# EAGLE design HWProgUSB (EAGLE 6.3)
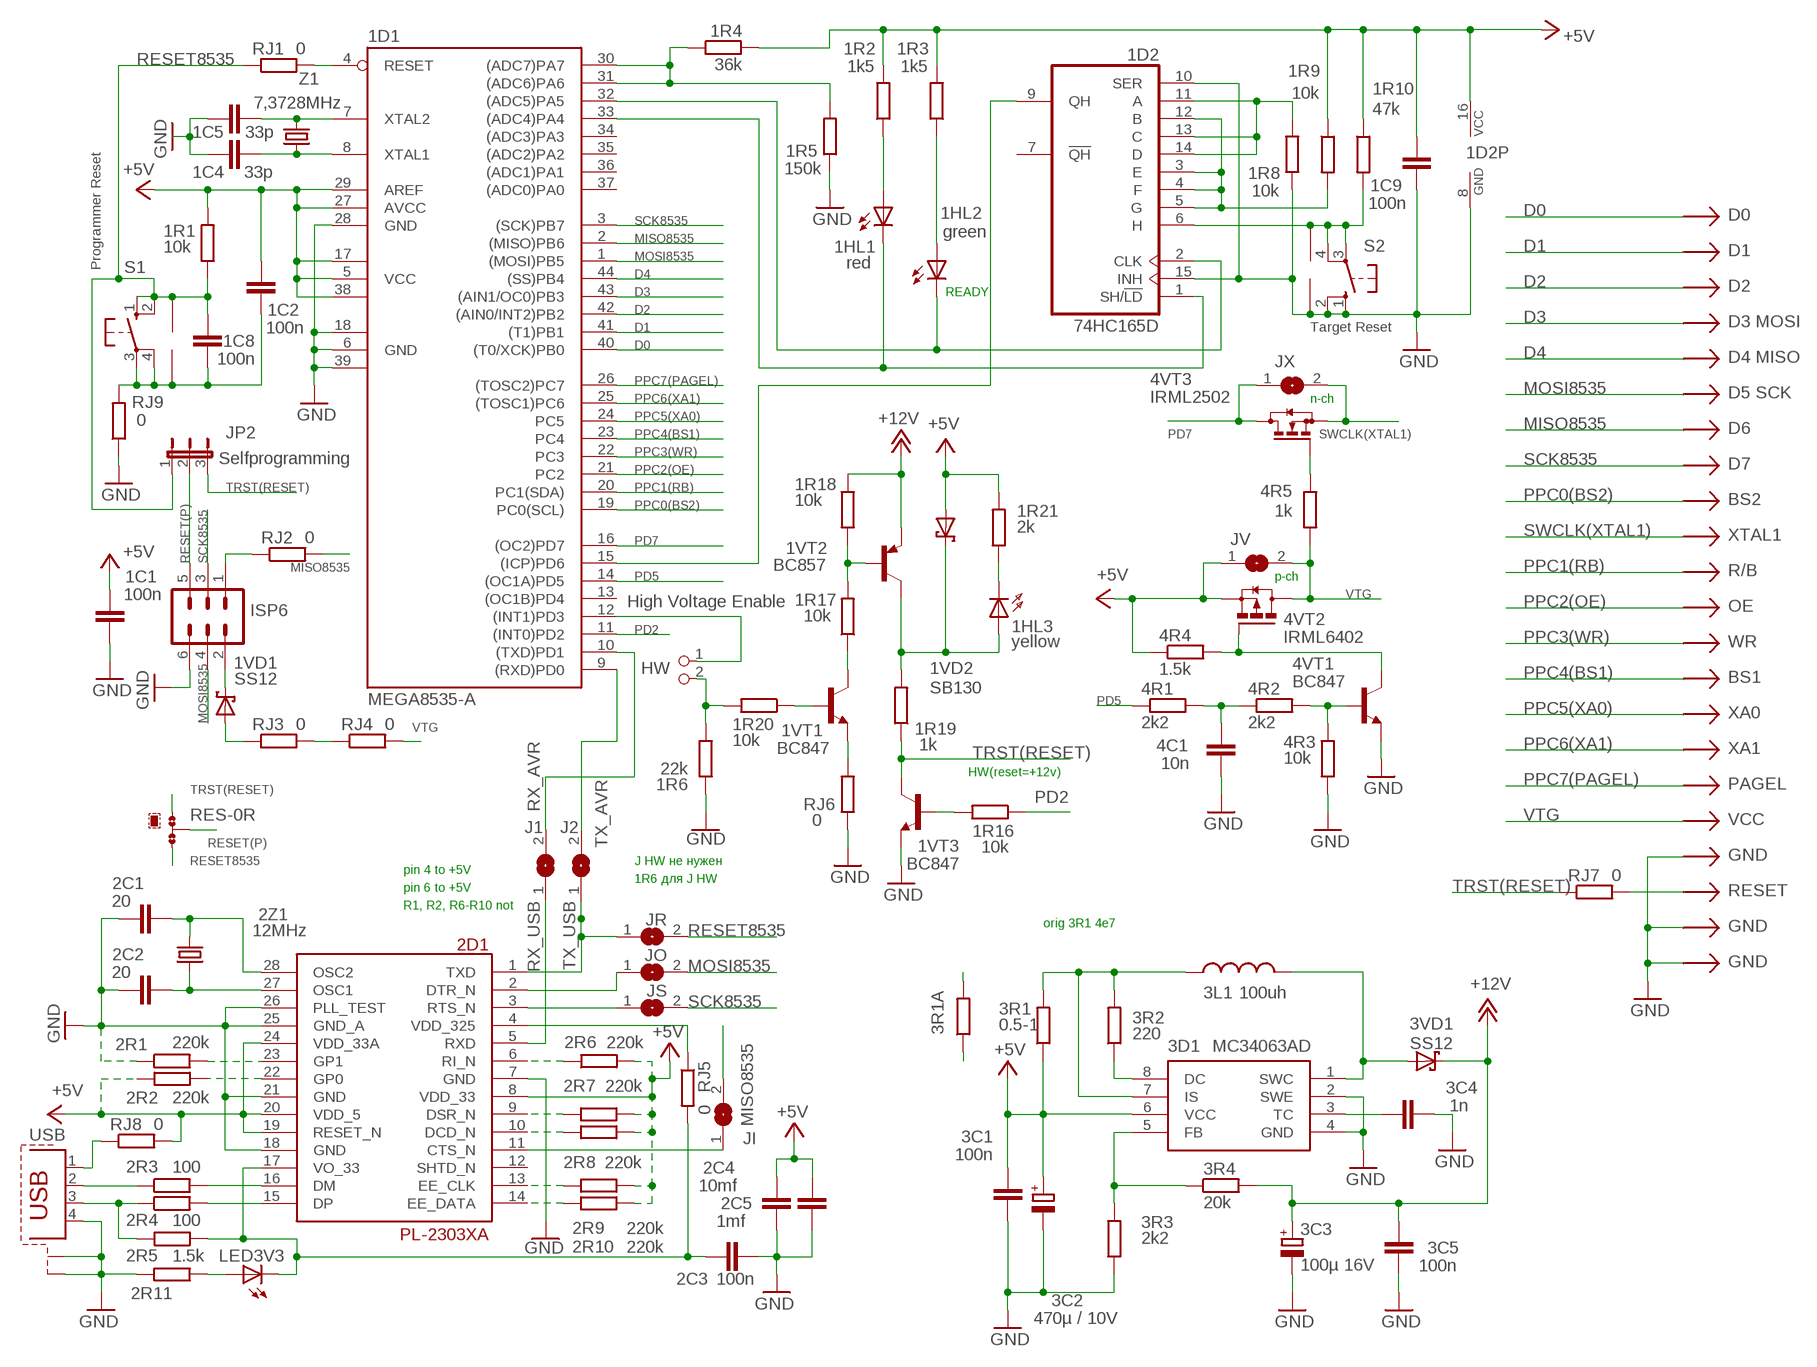
[diagram p0: schematic, sheet 1]

## Parts
1C1  100n  C-EUC0805  [C0805]
1C2  100n  C-EUC0805  [C0805]
1C4  33p  C-EUC0805  [C0805]
1C5  33p  C-EUC0805  [C0805]
1C8  100n  C-EUC0805  [C0805]
1C9  100n  C-EUC0805  [C0805]
1D1  MEGA8535-A  [TQFP44]
1D2  74HC165D  [SO16]
1HL1  red  LED5MM  [LED5MM]
1HL2  green  LED5MM  [LED5MM]
1HL3  yellow  LED5MM  [LED5MM]
1R1  10k  R-EU_M0805  [M0805]
1R2  1k5  R-EU_M0805  [M0805]
1R3  1k5  R-EU_M0805  [M0805]
1R4  36k  R-EU_M0805  [M0805]
1R5  150k  R-EU_R1206  [R1206]
1R6  22k  R-EU_M1206  [M1206]
1R8  10k  R-EU_M0805  [M0805]
1R9  10k  R-EU_M0805  [M0805]
1R10  47k  R-EU_M0805  [M0805]
1R16  10k  R-EU_R0805  [R0805]
1R17  10k  R-EU_M0805  [M0805]
1R18  10k  R-EU_M0805  [M0805]
1R19  1k  R-EU_M0805  [M0805]
1R20  10k  R-EU_M0805  [M0805]
1R21  2k  R-EU_R1206W  [R1206W]
1VD1  SS12  SCHOTTKY-DIODESMD  [SMB]
1VD2  SB130  SCHOTTKY-DIODESMD  [SMB]
1VT1  BC847  [SOT23]
1VT2  BC857  BC857A-PNP-SOT23-BEC  [SOT23-BEC]
1VT3  BC847  [SOT23]
2C1  20  C-EUC0805  [C0805]
2C2  20  C-EUC0805  [C0805]
2C3  100n  C-EUC0805  [C0805]
2C4  10mf  C-EUC1210  [C1210]
2C5  1mf  C-EUC0805  [C0805]
2D1  PL-2303XA  [SSOP28DB]
2R1  220k  R-EU_R0603  [R0603]
2R2  220k  R-EU_R1206W  [R1206W]
2R3  100  R-EU_R0603  [R0603]
2R4  100  R-EU_R0603  [R0603]
2R5  1.5k  R-EU_R0603  [R0603]
2R6  220k  R-EU_R1206W  [R1206W]
2R7  220k  R-EU_R0603  [R0603]
2R8  220k  R-EU_R0603  [R0603]
2R9  220k  R-EU_R0603  [R0603]
2R10  220k  R-EU_R0603  [R0603]
2R11  R-EU_R0603  [R0603]
2Z1  12MHz  CRYSTALHC49S  [HC49/S]
3C1  100n  C-EU025-024X044  [C025-024X044]
3C2  470µ / 10V  RCL_CPOL-EUE3.5-8  [RCL_E3,5-8]
3C3  100µ 16V  RCL_CPOL-EUE3.5-8  [RCL_E3,5-8]
3C4  1n  C-EU025-025X050  [C025-025X050]
3C5  100n  C-EU025-025X050  [C025-025X050]
3D1  MC34063AD  [SOIC8]
3L1  100uh  L-US0207/10  [0207/10]
3R1  0.5-1  R-EU_0204/7  [0204/7]
3R1A  R-EU_0204/7  [0204/7]
3R2  220  R-EU_0204/7  [0204/7]
3R3  2k2  R-EU_M0805  [M0805]
3R4  20k  R-EU_M0805  [M0805]
3VD1  SS12  SCHOTTKY-DIODESMD  [SMB]
4C1  10n  C-EUC1206  [C1206]
4R1  2k2  R-EU_M0805  [M0805]
4R2  2k2  R-EU_M1206  [M1206]
4R3  10k  R-EU_M0805  [M0805]
4R4  1.5k  R-EU_M0805  [M0805]
4R5  1k  R-EU_M0805  [M0805]
4VT1  BC847  [SOT23]
4VT2  IRML6402  FDN360P  [SUPER-SOT3]
4VT3  IRML2502  BSS123  [SOT23]
HW  High Voltage Enable  PINHEAD_PINHD-1X2  [PINHEAD_1X02]
ISP6  MA03-2  [MA03-2]
J1  SJ  [SJ]
J2  SJ  [SJ]
JI  SJ  [SJ]
JO  SJ  [SJ]
JP2  Selfprogramming  JUMPER_JP2E  [JUMPER_JP2]
JR  SJ  [SJ]
JS  SJ  [SJ]
JV  SJ  [SJ]
JX  SJ  [SJ]
LED3V3  LEDCHIPLED_0603  [CHIPLED_0603]
RES  0R-JUMPA  [A0R-JMP]
RJ1  0  R-EU_R1206  [R1206]
RJ2  0  R-EU_R1206  [R1206]
RJ3  0  R-EU_R1206  [R1206]
RJ4  0  R-EU_R1206  [R1206]
RJ5  0  R-EU_R1206  [R1206]
RJ6  0  R-EU_R1206  [R1206]
RJ7  0  R-EU_R1206  [R1206]
RJ8  0  R-EU_R1206  [R1206]
RJ9  0  R-EU_R1206  [R1206]
S1  10-XX  [B3F-10XX]
S2  10-XX  [B3F-10XX]
U$1  5.08  [KEY]
U$2  5.08  [KEY]
USB  PROGRAMMER_PN61729-S  [PROGRAMMER_PN61729-S]
X2  P_AVR_P  [P_AVR]
Z1  7,3728MHz  CRYTALHC49U-V  [HC49U-V]

## Nets
3VUSB: 2C3.1 2D1.17(VO_33) 2R5.1 LED3V3.C RJ5.2
+5V: 1C1.2 1C2.2 1C9.1 1D1.5(VCC) 1D1.17(VCC1) 1D1.27(AVCC) 1D1.29(AREF) 1D1.38(VCC2) 1D2.16(VCC) 1R1.2 1R2.2 1R3.2 1R4.2 1R9.1 1R10.1 1R21.2 1VD2.A 2C4.2 2C5.2 2D1.8(VDD_33) 2D1.19(RESET_N) 2D1.20(VDD_5) 2D1.24(VDD_33A) 2R2.1 2R6.2 2R7.1 2R8.1 2R9.1 2R10.1 3C1.1 3C2.+ 3D1.6(VCC) 3R1.1 3R1A.1 4R4.1 4VT2.2(S) JV.1 RJ8.2
+12V: 1R18.2 1VT2.E 3C3.+ 3C5.2 3R4.2 3VD1.C
D0: 1D1.40((T0/XCK)PB0) X2.D0
D1: 1D1.41((T1)PB1) X2.D1
D2: 1D1.42((AIN0/INT2)PB2) X2.D2
D3: 1D1.43((AIN1/OC0)PB3) X2.D3
D4: 1D1.44((SS)PB4) X2.D4
GND: 1C1.1 1C4.1 1C5.1 1C9.2 1D1.6(GND) 1D1.18(GND1) 1D1.28(GND) 1D1.39(GND2) 1D2.8(GND) 1D2.10(SER) 1D2.15(INH) 1R5.1 1R6.1 1R8.1 1VT3.2(E) 2C1.1 2C2.1 2C3.2 2C4.1 2C5.1 2D1.7(GND) 2D1.18(GND) 2D1.21(GND) 2D1.25(GND_A) 2D1.26(PLL_TEST) 2R1.1 2R11.2 3C1.2 3C2.- 3C3.- 3C4.2 3C5.1 3D1.2(SWE) 3D1.4(GND) 3R3.1 4C1.1 4R3.1 4VT1.2(E) ISP6.6 RJ6.1 RJ9.1 S2.1(S) S2.2(S1) U$2.P$1 USB.4 USB.S1 USB.S2 X2.GND X2.GND2 X2.P$1(LGND)
MISO8535: 1D1.2((MISO)PB6) JI.2 RJ2.2 X2.D6
MOSI8535: 1D1.1((MOSI)PB5) ISP6.4 JO.2 X2.D5
N4: 1D1.33((ADC4)PA4) 1D2.1(SH/!LD) 1HL1.K(C)
N$1: RJ7.2 X2.RESET
N$2: 1D1.4(RESET) RJ1.2
N$3: ISP6.1 RJ2.1
N$4: 2D1.4(VDD_325) RJ5.1
N$5: 1VT1.2(E) RJ6.2
N$6: 1VD1.C ISP6.2
N$7: 2D1.9(DSR_N) 2R7.2
N$9: 1VD1.A RJ3.1
N$10: RJ3.2 RJ4.1
N$12: 1C5.2 1D1.7(XTAL2) Z1.2
N$13: 1C4.2 1D1.8(XTAL1) Z1.1
N$14: RJ8.1 USB.1
N$15: 1C2.1 1C8.1 RJ9.2 S1.3(P) S1.4(P1) U$1.P$1
N$20: 1HL3.K(C) 1R21.1
N$21: 4R5.2 4VT3.1(G)
N$22: 2R11.1 LED3V3.A
N$45: 2R4.1 2R5.2 USB.3
N$46: 2R3.1 USB.2
N$47: 2D1.15(DP) 2R4.2
N$48: 2D1.16(DM) 2R3.2
N$49: 2D1.23(GP1) 2R1.2
N$52: 2D1.22(GP0) 2R2.2
N$53: 2C1.2 2D1.28(OSC2) 2Z1.2
N$54: 2D1.11(CTS_N) JI.1
N$55: 4R2.2 4R3.2 4VT1.1(B)
N$56: 2C2.2 2D1.27(OSC1) 2Z1.1
N$58: 2D1.6(RI_N) 2R6.1
N$59: 4R4.2 4VT1.3(C) 4VT2.1(G)
N$60: 2D1.3(RTS_N) JS.1
N$62: 4C1.2 4R1.2 4R2.1
N$68: 2D1.13(EE_CLK) 2R9.2
N$69: 2D1.2(DTR_N) JO.1
N$70: 2D1.14(EE_DATA) 2R10.2
N$80: 2D1.10(DCD_N) 2R8.2
N$104: 3D1.8(DC) 3R2.1
N$105: 3D1.7(IS) 3L1.1 3R1.2 3R1A.2 3R2.2
N$106: 3D1.5(FB) 3R3.2 3R4.1
N$107: 3D1.1(SWC) 3L1.2 3VD1.A
N$108: 3C4.1 3D1.3(TC)
N$122: 1HL2.A 1R3.1
N$123: 1D1.30((ADC7)PA7) 1D1.31((ADC6)PA6) 1R4.1 1R5.2
N$124: 1D1.32((ADC5)PA5) 1D2.2(CLK) 1HL2.K(C)
N$125: 1D2.6(H) 1R10.2 S2.3(P) S2.4(P1) U$2.P$2
N$131: 1D1.12((INT1)PD3) HW.1
N$132: 1R6.2 1R20.2 HW.2
N$133: 1HL3.A 1R19.2 1VD2.C 1VT2.C
N$134: 1R20.1 1VT1.1(B)
N$135: 1R17.1 1VT1.3(C)
N$136: 1R17.2 1R18.1 1VT2.B
N$137: 1D1.15((ICP)PD6) 1D2.9(QH)
N$138: 1HL1.A 1R2.1
N$139: 1D2.11(A) 1D2.13(C) 1D2.14(D) 1R8.2
N$140: 1D2.3(E) 1D2.4(F) 1D2.5(G) 1D2.12(B) 1R9.2
N$141: 1R16.2 1VT3.1(B)
PD2: 1D1.11((INT0)PD2) 1R16.1
PD5: 1D1.14((OC1A)PD5) 4R1.1
PD7: 1D1.16((OC2)PD7) 4VT3.3(D) JX.1
PPC0(BS2): 1D1.19(PC0(SCL)) X2.BS2
PPC1(RB): 1D1.20(PC1(SDA)) X2.RB
PPC2(OE): 1D1.21(PC2) X2.OE
PPC3(WR): 1D1.22(PC3) X2.WR
PPC4(BS1): 1D1.23(PC4) X2.BS1
PPC5(XA0): 1D1.24(PC5) X2.XA0
PPC6(XA1): 1D1.25((TOSC1)PC6) X2.XA1
PPC7(PAGEL): 1D1.26((TOSC2)PC7) X2.PAGEL
RESET8535: 1C8.2 1R1.1 JP2.1 JR.2 RES.3 RJ1.1 S1.1(S) S1.2(S1) U$1.P$2
RESET(P): ISP6.5 JP2.2 RES.2
RX_AVR: 1D1.10((TXD)PD1) J1.2
RX_USB: 2D1.5(RXD) J1.1
SCK8535: 1D1.3((SCK)PB7) ISP6.3 JS.2 X2.D7
SWCLK(XTAL1): 4VT3.2(S) JX.2 X2.XTAL1
TRST(RESET): 1R19.1 1VT3.3(C) JP2.3 RES.1 RJ7.1
TX_AVR: 1D1.9((RXD)PD0) J2.2
TX_USB: 2D1.1(TXD) J2.1 JR.1
VTG: 4R5.1 4VT2.3(D) JV.2 RJ4.2 X2.VCC
Unconnected: 1D1.13((OC1B)PD4) 1D1.34((ADC3)PA3) 1D1.35((ADC2)PA2) 1D1.36((ADC1)PA1) 1D1.37((ADC0)PA0) 1D2.7(!QH) 2D1.12(SHTD_N)

## Notes on the sheet
- Programmer Reset
- READY
- Target Reset
- n-ch
- p-ch
- HW(reset=+12v)
- J HW не нужен
- pin 4 to +5V
- 1R6 для J HW
- pin 6 to +5V
- R1, R2, R6-R10 not
- orig 3R1 4e7

## Library data of the parts
1C1 1C2 1C4 1C5 1C8 1C9 2C4 2C5 3C4 3C5 4C1 = rcl:C-EU: CAPACITOR, European symbol
1D1 = atmel:MEGA8535: MICROCONTROLLER 8 Kbytes FLASH 512 bytes SRAM 512 bytes EEPROM USART 8-channel 10 bit ADC Source: avr.lbr; MPN: ATMEGA8535-16AU; OC_FARNELL: 1528437; OC_NEWARK: 01M6908
1D2 = 74xx-eu:74*165: 8-bit parallel load SHIFT REGISTER
1HL1 1HL2 LED3V3 = led:LED: LED OSRAM: - CHIPLED LG R971, LG N971, LY N971, LG Q971, LY Q971, LO R971, LY R971 LH N974, LH R974 LS Q976, LO Q976, LY Q976 LO Q996 - Hyper CHIPLED LW Q18S LB Q993, LB Q99A, LB R99A - SideLED LS A670, LO A670, LY A670, LG A670, LP A670 LB A673, LV A673, LT A673, LW A673 LH A674 LY A675 LS A676, LA A676, LO A676, LY A676, LW A676 LS A679, LY A679, LG A679 - Hyper Micro SIDELED® LS Y876, LA Y876, LO Y876, LY Y876 LT Y87S - SmartLED LW L88C, LW L88S LB L89C, LB L89S, LG L890 LS L89K, LO L89K, LY L89K LS L896, LA L896, LO L896, LY L896 - TOPLED LS T670, LO T670, LY T670, LG T670, LP T670 LSG T670, LSP T670, LSY T670, LOP T670, LYG T670 LG T671, LOG T671, LSG T671 LB T673, LV T673, LT T673, LW T673 LH T674 LS T676, LA T676, LO T676, LY T676, LB T676, LH T676, LSB T676, LW T676 LB T67C, LV T67C, LT T67C, LS T67K, LO T67K, LY T67K, LW E67C LS E67B, LA E67B, LO E67B, LY E67B, LB E67C, LV E67C, LT E67C LW T67C LS T679, LY T679, LG T679 LS T770, LO T770, LY T770, LG T770, LP T770 LB T773, LV T773, LT T773, LW T773 LH T774 LS E675, LA E675, LY E675, LS T675 LS T776, LA T776, LO T776, LY T776, LB T776 LHGB T686 LT T68C, LB T68C - Hyper Mini TOPLED® LB M676 - Mini TOPLED Santana® LG M470 LS M47K, LO M47K, LY M47K Source: http://www.osram.convergy.de LUXEON: - LUMILED® LXK2-PW12-R00, LXK2-PW12-S00, LXK2-PW14-U00, LXK2-PW14-V00 LXK2-PM12-R00, LXK2-PM12-S00, LXK2-PM14-U00 LXK2-PE12-Q00, LXK2-PE12-R00, LXK2-PE12-S00, LXK2-PE14-T00, LXK2-PE14-U00 LXK2-PB12-K00, LXK2-PB12-L00, LXK2-PB12-M00, LXK2-PB14-N00, LXK2-PB14-P00, LXK2-PB14-Q00 LXK2-PR12-L00, LXK2-PR12-M00, LXK2-PR14-Q00, LXK2-PR14-R00 LXK2-PD12-Q00, LXK2-PD12-R00, LXK2-PD12-S00 LXK2-PH12-R00, LXK2-PH12-S00 LXK2-PL12-P00, LXK2-PL12-Q00, LXK2-PL12-R00 Source: www.luxeon.com KINGBRIGHT: KA-3528ASYC Source: www.kingbright.com
1HL3 = rc-elektronik:LED: LED OSRAM: - CHIPLED LG R971, LG N971, LY N971, LG Q971, LY Q971, LO R971, LY R971 LH N974, LH R974 LS Q976, LO Q976, LY Q976 LO Q996 - Hyper CHIPLED LW Q18S LB Q993, LB Q99A, LB R99A - SideLED LS A670, LO A670, LY A670, LG A670, LP A670 LB A673, LV A673, LT A673, LW A673 LH A674 LY A675 LS A676, LA A676, LO A676, LY A676, LW A676 LS A679, LY A679, LG A679 - Hyper Micro SIDELED® LS Y876, LA Y876, LO Y876, LY Y876 LT Y87S - SmartLED LW L88C, LW L88S LB L89C, LB L89S, LG L890 LS L89K, LO L89K, LY L89K LS L896, LA L896, LO L896, LY L896 - TOPLED LS T670, LO T670, LY T670, LG T670, LP T670 LSG T670, LSP T670, LSY T670, LOP T670, LYG T670 LG T671, LOG T671, LSG T671 LB T673, LV T673, LT T673, LW T673 LH T674 LS T676, LA T676, LO T676, LY T676, LB T676, LH T676, LSB T676, LW T676 LB T67C, LV T67C, LT T67C, LS T67K, LO T67K, LY T67K, LW E67C LS E67B, LA E67B, LO E67B, LY E67B, LB E67C, LV E67C, LT E67C LW T67C LS T679, LY T679, LG T679 LS T770, LO T770, LY T770, LG T770, LP T770 LB T773, LV T773, LT T773, LW T773 LH T774 LS E675, LA E675, LY E675, LS T675 LS T776, LA T776, LO T776, LY T776, LB T776 LHGB T686 LT T68C, LB T68C - Hyper Mini TOPLED® LB M676 - Mini TOPLED Santana® LG M470 LS M47K, LO M47K, LY M47K Source: http://www.osram.convergy.de LUXEON: - LUMILED® LXK2-PW12-R00, LXK2-PW12-S00, LXK2-PW14-U00, LXK2-PW14-V00 LXK2-PM12-R00, LXK2-PM12-S00, LXK2-PM14-U00 LXK2-PE12-Q00, LXK2-PE12-R00, LXK2-PE12-S00, LXK2-PE14-T00, LXK2-PE14-U00 LXK2-PB12-K00, LXK2-PB12-L00, LXK2-PB12-M00, LXK2-PB14-N00, LXK2-PB14-P00, LXK2-PB14-Q00 LXK2-PR12-L00, LXK2-PR12-M00, LXK2-PR14-Q00, LXK2-PR14-R00 LXK2-PD12-Q00, LXK2-PD12-R00, LXK2-PD12-S00 LXK2-PH12-R00, LXK2-PH12-S00 LXK2-PL12-P00, LXK2-PL12-Q00, LXK2-PL12-R00 Source: www.luxeon.com KINGBRIGHT: KA-3528ASYC Source: www.kingbright.com
1R1-1R6 1R8-1R10 1R16-1R21 3R1 3R1A 3R2-3R4 4R1-4R5 RJ1-RJ9 = rcl:R-EU_: RESISTOR, European symbol
1VD1 1VD2 3VD1 = diode:SCHOTTKY-DIODE: Schottky Diode
1VT1 1VT3 = transistor:BC847: NPN TRANSISTOR
1VT2 = transistor:*-PNP-: PNP Transistror
2C1-2C3 = resistor:C-EU: CAPACITOR, European symbol
2D1 = SparkFun-DigitalIC:PL-2303XA: Prolific USB chip, requires 12MHz xtal
2R1-2R11 = resistor:R-EU_: RESISTOR, European symbol
2Z1 = crystal:CRYSTAL: CRYSTAL; OC_FARNELL: 1667008; OC_NEWARK: unknown
3C1 = rc-elektronik:C-EU: CAPACITOR, European symbol
3C2 3C3 = HWProgUSB:RCL_CPOL-EU: POLARIZED CAPACITOR, European symbol
3D1 = mc34063:MC34063
3L1 = rcl:L-US: INDUCTOR, American symbol
4VT1 = transistor-neu-to92:BC847: NPN TRANSISTOR
4VT2 = transistor-power:FDN360P: Single P-Channel, PowerTrench (R) MOSFET Source: http://www.fairchildsemi.com/ds/FD/FDN360P.pdf
4VT3 = transistor-small-signal:BSS123: N-CHANNEL MOS FET
HW = HWProgUSB:PINHEAD_PINHD-1X2: PIN HEADER
ISP6 = con-lstb:MA03-2: PIN HEADER
J1 J2 JI JO JR JS JV JX = jumper:SJ: SMD solder JUMPER
JP2 = HWProgUSB:JUMPER_JP2E: JUMPER
RES = jump-0r-smd:0R-JUMP: SMD 0R 0805 Jumper
S1 S2 = switch-omron:10-XX: OMRON SWITCH
U$1 U$2 = Programmer:5.08
USB = HWProgUSB:PROGRAMMER_PN61729-S: BERG USB connector
X2 = Programmer:P_AVR
Z1 = crystal:CRYTAL: CRYSTAL

## Board
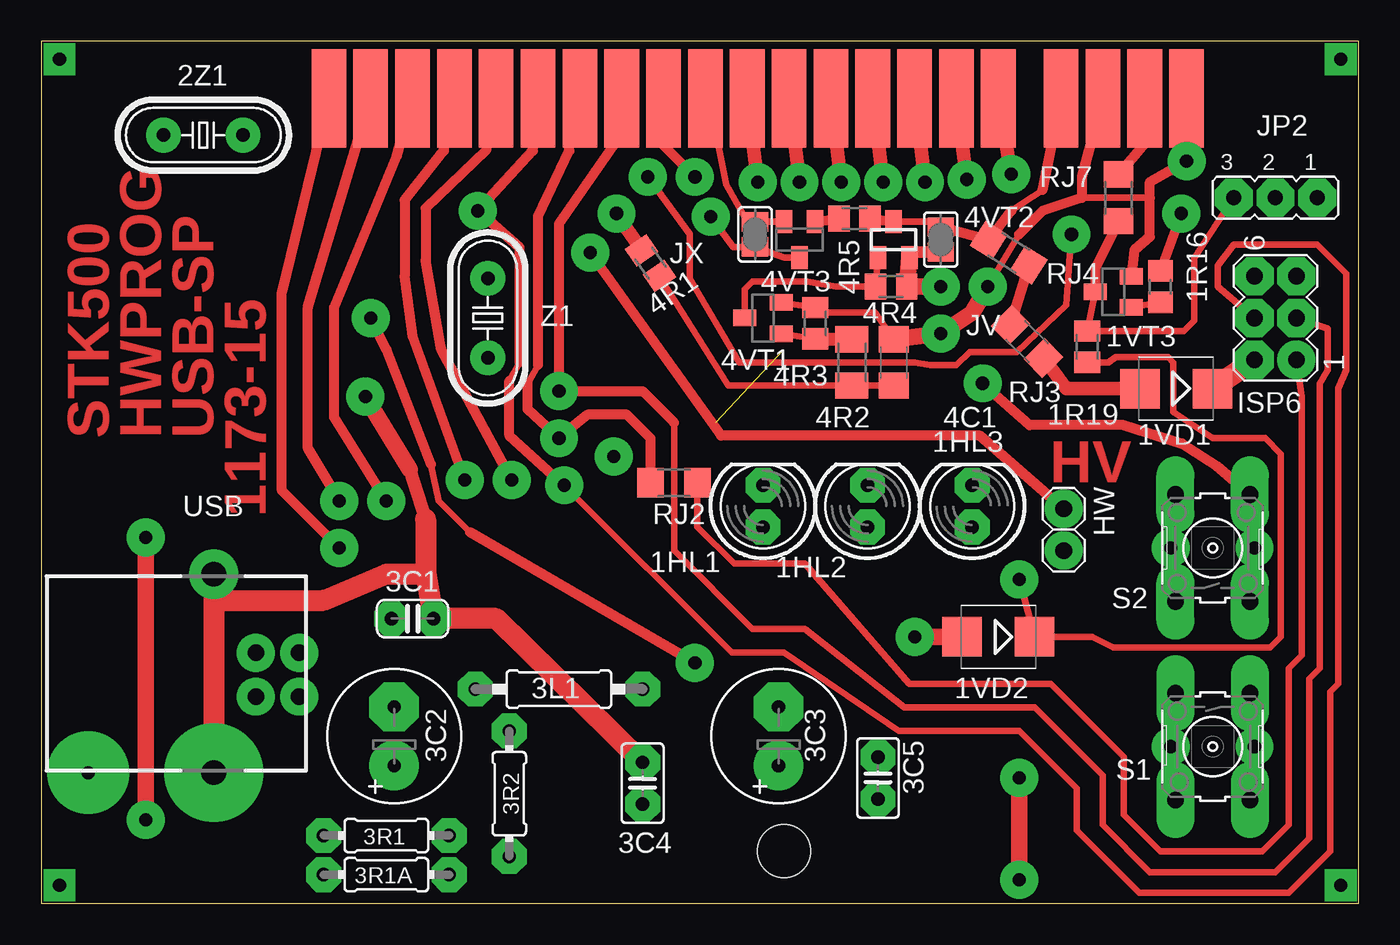
[diagram p1: board, top side]
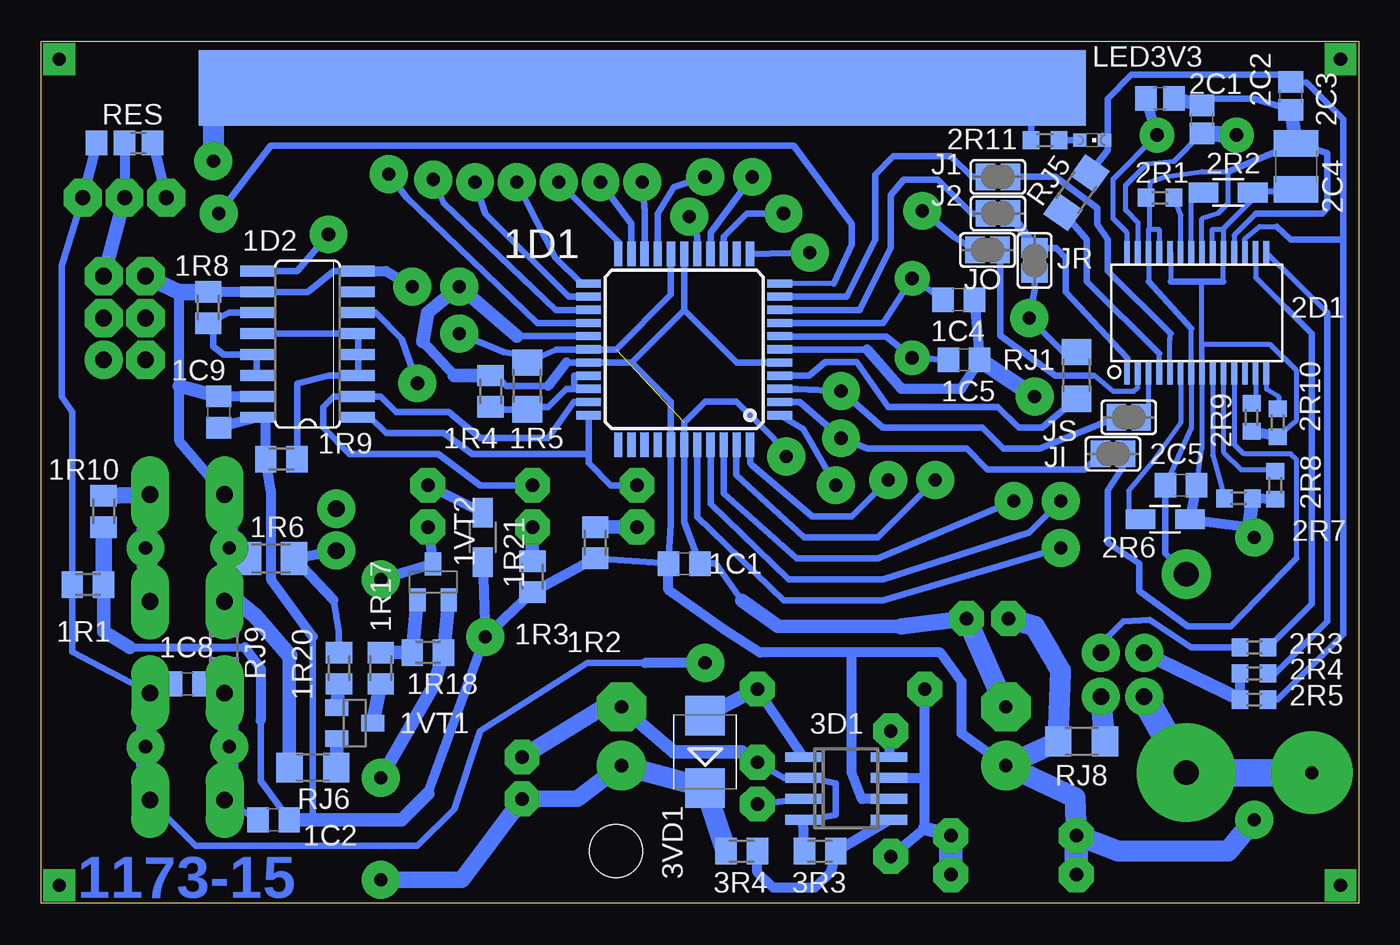
[diagram p2: board, bottom side, seen from below]

Size 79.99 x 52.38 mm. Coordinates in mm from the lower left corner, seen from the top.
Outline: 0,0 79.99,0 79.99,52.38 0,52.38 0,0
Copper layers (1*16): Top 0.035mm / dielectric 1.5mm / Bottom 0.035mm
Design rules "DesignRules": minimum track width 8mil, minimum drill 24mil, track to track 0.2mm, track to pad 0.2mm, pad to pad 8mil, via to via 8mil, smd to smd 8mil, copper to edge 10mil, drill to drill 8mil, minimum pad ring 0.65mm, minimum via ring 8mil, stop-mask expansion 4mil, vias tented up to drill 0mil, thermal gap 10mil
Holes 3.2 mm at 45.09,3.17

### Footprints (pad centres in the part's own frame; a part is rotated, then mirrored left to right if it is on the bottom)
C0805 = smd 1.3 x 1.5: 1 -0.95,0; 2 0.95,0
TQFP44 = smd 1.5 x 0.5: 1 -5.8,4; 2 -5.8,3.2; 3 -5.8,2.4; 4 -5.8,1.6; 5 -5.8,0.8; 6 -5.8,0; 7 -5.8,-0.8; 8 -5.8,-1.6; 9 -5.8,-2.4; 10 -5.8,-3.2; 11 -5.8,-4; 23 5.8,-4; 24 5.8,-3.2; 25 5.8,-2.4; 26 5.8,-1.6; 27 5.8,-0.8; 28 5.8,0; 29 5.8,0.8; 30 5.8,1.6; 31 5.8,2.4; 32 5.8,3.2; 33 5.8,4 | smd 0.5 x 1.5: 12 -4,-5.8; 13 -3.2,-5.8; 14 -2.4,-5.8; 15 -1.6,-5.8; 16 -0.8,-5.8; 17 0,-5.8; 18 0.8,-5.8; 19 1.6,-5.8; 20 2.4,-5.8; 21 3.2,-5.8; 22 4,-5.8; 34 4,5.8; 35 3.2,5.8; 36 2.4,5.8; 37 1.6,5.8; 38 0.8,5.8; 39 0,5.8; 40 -0.8,5.8; 41 -1.6,5.8; 42 -2.4,5.8; 43 -3.2,5.8; 44 -4,5.8
SO16 = smd 0.66 x 2.032: 1 -4.445,-3.073; 2 -3.175,-3.073; 3 -1.905,-3.073; 4 -0.635,-3.073; 5 0.635,-3.073; 6 1.905,-3.073; 7 3.175,-3.073; 8 4.445,-3.073; 9 4.445,3.073; 10 3.175,3.073; 11 1.905,3.073; 12 0.635,3.073; 13 -0.635,3.073; 14 -1.905,3.073; 15 -3.175,3.073; 16 -4.445,3.073
LED5MM = drill 0.813 octagon: A -1.27,0; K 1.27,0
M0805 = smd 1.3 x 1.6: 1 -0.95,0; 2 0.95,0
R1206 = smd 1.6 x 1.803: 1 -1.422,0; 2 1.422,0
M1206 = smd 1.6 x 2: 1 -1.4,0; 2 1.4,0
R0805 = smd 1.3 x 1.5: 1 -0.95,0; 2 0.95,0
R1206W = smd 1.8 x 1.2: 1 -1.499,0; 2 1.499,0
SMB = smd 2.4 x 2.4: A 2.2,0; C -2.2,0
SOT23 = smd 1 x 1.4: 1 -0.95,-1.1; 2 0.95,-1.1; 3 0,1.1
SOT23-BEC = smd 1 x 1.4: B -0.95,-1.1; C 0,1.1; E 0.95,-1.1
C0805' = smd 1.3 x 1.5: 1 -0.85,0; 2 0.85,0
C1210 = smd 1.6 x 2.7: 1 -1.4,0; 2 1.4,0
SSOP28DB = smd 0.348 x 1.397: 1 -4.225,-3.656; 2 -3.575,-3.656; 3 -2.925,-3.656; 4 -2.275,-3.656; 5 -1.625,-3.656; 6 -0.975,-3.656; 7 -0.325,-3.656; 8 0.325,-3.656; 9 0.975,-3.656; 10 1.625,-3.656; 11 2.275,-3.656; 12 2.925,-3.656; 13 3.575,-3.656; 14 4.225,-3.656; 15 4.225,3.656; 16 3.575,3.656; 17 2.925,3.656; 18 2.275,3.656; 19 1.625,3.656; 20 0.975,3.656; 21 0.325,3.656; 22 -0.325,3.656; 23 -0.975,3.656; 24 -1.625,3.656; 25 -2.275,3.656; 26 -2.925,3.656; 27 -3.575,3.656; 28 -4.225,3.656
R0603 = smd 1 x 1.1: 1 -0.85,0; 2 0.85,0
HC49/S = drill 0.813: 1 -2.413,0; 2 2.413,0
C025-024X044 = drill 0.813 octagon: 1 -1.27,0; 2 1.27,0
RCL_E3,5-8 = drill 0.813 pad 3: + -1.778,0 | drill 0.813 pad 3 octagon: - 1.778,0
C025-025X050 = drill 0.813 octagon: 1 -1.27,0; 2 1.27,0
SOIC8 = smd 0.6 x 2.2: 1 -1.905,-2.6; 2 -0.635,-2.6; 3 0.635,-2.6; 4 1.905,-2.6; 5 1.905,2.6; 6 0.635,2.6; 7 -0.635,2.6; 8 -1.905,2.6
0207/10 = drill 0.813 octagon: 1 -5.08,0; 2 5.08,0
0204/7 = drill 0.813 octagon: 1 -3.81,0; 2 3.81,0
C1206 = smd 1.6 x 1.8: 1 -1.4,0; 2 1.4,0
SUPER-SOT3 = smd 1 x 1.4: 1 -0.95,-1.1; 2 0.95,-1.1; 3 0,1.1
PINHEAD_1X02 = drill 1.016 pad 2.3: 1 -1.27,0; 2 1.27,0
MA03-2 = drill 1.016: 1 -2.54,-1.27 | drill 1.016 octagon: 2 -2.54,1.27; 3 0,-1.27; 4 0,1.27; 5 2.54,-1.27; 6 2.54,1.27
SJ = smd 1.168 x 1.6: 1 -0.762,0; 2 0.762,0
JUMPER_JP2 = drill 0.914 pad 2.3 octagon: 1 -2.54,0; 2 0,0; 3 2.54,0
CHIPLED_0603 = smd 0.8 x 0.8: A 0,-0.75; C 0,0.75
A0R-JMP = smd 1.5 x 1.3: 1 0,1.7; 2 0,0; 3 0,-1.7
B3F-10XX = drill 1.016 long: 1 -3.251,2.261; 2 3.251,2.261; 3 -3.251,-2.261; 4 3.251,-2.261
KEY = drill 0.8 pad 2.3: P$1 -2.54,0.635; P$2 2.54,0.635
PROGRAMMER_PN61729-S = drill 1 pad 2: 1 1.409,5.186; 2 -1.25,5.186; 3 -1.25,2.551; 4 1.409,2.551 | drill 1.5 pad 3: S1 -6.02,0 | drill 1.5 pad 6: S2 6.02,0
P_AVR = smd 6 x 2.1: BS1 0,-34.925; BS2 0,-22.225; D0 0,-1.905; D1 0,-4.445; D2 0,-6.985; D3 0,-9.525; D4 0,-12.065; D5 0,-14.605; D6 0,-17.145; D7 0,-19.685; GND 0,-48.895; GND2 0,-53.975; OE 0,-29.845; PAGEL 0,-42.545; RB 0,-27.305; RESET 0,-51.435; VCC 0,-46.355; WR 0,-32.385; XA0 0,-37.465; XA1 0,-40.005; XTAL1 0,-24.765 | smd 4.572 x 53.848 bottom: P$1 0.635,-27.94
HC49U-V = drill 0.813: 1 -2.413,0; 2 2.413,0

### Placement (x,y rotation side)
1C1  40.96,20.64 180 bottom
1C2  65.88,5.08 0 bottom
1C4  24.29,36.67 180 bottom
1C5  23.97,33.02 180 bottom
1C8  71.12,13.34 180 bottom
1C9  69.22,29.84 90 bottom
1D1  40.96,33.66 180 bottom
1D2  63.82,33.97 90 bottom
1HL1  43.81,24.13 90 top
1HL2  50.16,24.13 90 top
1HL3  56.52,24.13 90 top
1R1  77.15,19.37 0 bottom
1R2  46.35,21.91 270 bottom
1R3  50.16,19.84 270 bottom
1R4  52.7,31.11 90 bottom
1R5  50.48,31.43 270 bottom
1R6  66.04,20.95 0 bottom
1R8  69.85,36.2 270 bottom
1R9  65.41,26.99 0 bottom
1R10  76.2,23.81 90 bottom
1R16  67.94,37.47 270 top
1R17  59.37,14.29 90 bottom
1R18  56.52,15.24 0 bottom
1R19  63.5,33.81 270 top
1R20  61.91,14.29 90 bottom
1R21  53.18,22.23 270 bottom
1VD1  68.9,31.27 180 top
1VD2  58.1,16.19 180 top
1VT1  60.96,10.95 270 bottom
1VT2  56.2,19.53 0 bottom
1VT3  65.09,37.15 90 top
2C1  20  [C0805']  12.06,48.9 180 bottom
2C2  20  [C0805']  9.53,47.62 270 bottom
2C3  100n  [C0805']  4.13,49.05 270 bottom
2C4  3.81,44.77 270 bottom
2C5  10.79,25.4 0 bottom
2D1  9.84,35.88 0 bottom
2R1  12.06,42.86 0 bottom
2R2  7.94,43.18 180 bottom
2R3  6.35,15.56 0 bottom
2R4  6.35,13.97 0 bottom
2R5  6.35,12.38 180 bottom
2R6  11.75,23.34 0 bottom
2R7  7.3,24.61 180 bottom
2R8  5.08,25.4 90 bottom
2R9  6.51,29.53 90 bottom
2R10  4.92,29.21 90 bottom
2R11  19.05,46.35 180 bottom
2Z1  9.84,46.67 0 top
3C1  22.54,17.3 0 top
3C2  21.43,10.16 90 top
3C3  44.77,10.16 90 top
3C4  36.51,7.3 90 top
3C5  50.8,7.62 270 top
3D1  31.11,6.99 270 bottom
3L1  31.43,13.02 0 top
3R1  20.95,4.13 0 top
3R1A  20.95,1.75 0 top
3R2  28.42,6.67 270 top
3R3  32.7,3.17 0 bottom
3R4  37.47,3.17 180 bottom
3VD1  39.69,9.21 90 bottom
4C1  51.75,32.86 270 top
4R1  36.99,38.89 305 top
4R2  49.21,32.86 90 top
4R3  46.99,35.24 270 top
4R4  51.59,37.47 180 top
4R5  49.37,41.59 180 top
4VT1  43.81,35.56 90 top
4VT2  51.75,40.32 0 top
4VT3  46.04,40.32 180 top
HW  62.07,22.7 270 top
ISP6  74.93,35.56 90 top
J1  21.91,44.13 180 bottom
J2  21.91,41.91 180 bottom
JI  14.92,27.3 180 bottom
JO  22.54,39.69 180 bottom
JP2  74.93,42.86 180 top
JR  19.68,39.05 270 bottom
JS  13.97,29.53 180 bottom
JV  54.61,40.32 90 top
JX  43.34,40.64 90 top
LED3V3  16.19,46.35 270 bottom
RES  74.93,46.2 270 bottom
RJ1  17.14,32.07 270 bottom
RJ2  38.42,25.56 180 top
RJ3  59.85,34.13 135 top
RJ4  58.74,39.53 148 top
RJ5  17.14,43.18 55 bottom
RJ6  63.5,8.26 0 bottom
RJ7  65.41,42.86 90 top
RJ8  16.83,9.84 180 bottom
RJ9  68.9,15.56 270 bottom
S1  71.12,9.53 270 top
S2  71.12,21.59 90 top
U$1  71.12,8.89 0 top
U$2  71.12,20.95 0 top
USB  10.48,13.97 270 top
X2  15.56,48.9 90 top
Z1  27.11,35.56 270 top

### Tracks (layer width: path | path; a pad name or v marks a point on that pad's centre or on a via)
3VUSB
  Bottom 0.305: 2D1.17 6.92,40.39 6.03,41.12 4.98,41.12
  Bottom 0.406: RJ5.2 15.24,45.75 15.24,46.35 | 15.24,46.35 15.24,48.9 13.81,50.32 4.71,50.32 2C3.1 3.17,49.85 0.95,47.62 0.95,40.32 | 0.95,40.32 0.95,16.35 4.92,12.38 2R5.1 | 4.98,41.12 4.13,40.32 0.95,40.32 | LED3V3.C 15.24,46.35
+5V  (via drill 0.8 pad 2.3)
  Top 0.406: 53.04,39.56 4VT2.2
  Top 0.7: JV.1 53.04,39.56
  Top 1.016: 4VT2.2 4R4.1 v54.61,37.47 | v6.35,5.08 v6.35,22.23 | v53.02,16.19 1VD2.A
  Bottom 0.305: 8.22,40.96 8.89,40.96 8.89,39.53 2D1.20 | 8.22,40.96 2D1.19 8.22,37.78 | 2D1.24 11.43,39.53 11.43,37.78 | 2D1.8 9.52,33.97 5.4,33.97 3.81,32.38 3.81,29.31 2R10.1 | 2D1.8 9.53,37.78 | 2R2.1 6.44,42.77 8.22,40.99 8.22,40.96 | 2D1.8 9.53,27.62 2C5.2
  Bottom 0.406: 48.11,32.85 1D1.29 44.13,32.86 | 49.21,31.43 51.75,31.43 52.07,31.75 52.39,31.75 1R4.2 | 1D1.27 51.12,34.45 | 8.22,37.78 9.53,37.78 11.43,37.78 | 66.36,29.53 1D2.16 | 1D1.5 37.78,32.85 40.96,36.04 | 1D1.17 40.96,36.04 | 40.96,36.04 44.13,32.86 | 44.13,32.86 41.76,30.49 1D1.38 41.76,23.01 1C1.2 1R2.2 | 2R2.1 2C4.2 | 63.5,16.19 63.5,5.08 | 66.67,11.11 66.67,7.46 1C2.2 | 58.26,5.08 58.1,5.08
  Bottom 0.5: 74.61,15.56 67.63,15.56
  Bottom 0.61: 48.11,32.85 49.21,31.43 | 54.93,32.07 56.83,34.13 | 2R10.1 2R9.1 | 2R8.1 2R7.1 | 6.67,22.86 2R6.2 2C5.2 | 1R2.2 1R3.2 v53.02,16.19 | 3D1.6 30.16,6.35 30.8,7.94 30.8,15.24 | 63.5,16.19 66.04,19.68 66.04,25.08 1R9.1 66.36,29.53 | 67.63,15.56 66.67,14.29 66.67,11.11 | 56.52,6.67 v53.02,16.19 | 3C2.+ 24.13,10.32 24.13,13.49 25.4,15.24 30.8,15.24 | 30.8,15.24 36.35,15.24 38.58,16.67 41.91,19.05 1C1.2 | 1D2.16 1C9.1 | 1R21.2 v53.02,16.19
  Bottom 0.813: 1R4.2 54.93,32.07 | 56.83,34.13 56.52,35.88 v54.61,37.47 51.12,34.45 | 1R1.2 76.2,16.51 74.61,15.56 | 1C2.2 63.5,5.08 58.26,5.08 | v6.35,22.23 6.67,22.86 2R7.1 | 58.1,5.08 56.52,6.67
  Bottom 1.016: 1R1.2 1R10.1
  Bottom 1.27: v6.35,5.08 7.94,3.17 14.61,3.17 3R1.1 17.24,6.43 3C2.+ RJ8.2 18.1,14.13 18.73,15.24 19.68,16.83 3C1.1
  Bottom 1.422: 3R1A.1 3R1.1
+12V  (via drill 0.8 pad 2.3)
  Top 1.016: v59.37,1.43 v59.37,7.62 59.37,7.78
  Bottom 0.813: v59.37,7.62 56.2,13.17 1R18.2 1VT2.E
  Bottom 1.016: v59.37,1.43 54.45,1.43 3C5.2 47.43,6.35 3C3.+
  Bottom 1.27: 3R4.2 3VD1.C 3C3.+
D0  (via drill 0.8 pad 2.3)
  Top 0.61: X2.D0 14.61,37.15 14.61,25.08 v18.1,21.59
  Bottom 0.406: 1D1.40 40.16,23.49 34.92,18.41 28.89,18.41 v18.1,21.59
D1  (via drill 0.8 pad 2.3)
  Top 0.61: X2.D1 16.19,36.2 16.19,27.62 v18.1,24.45
  Bottom 0.406: 1D1.41 39.36,24.28 34.61,19.68 28.89,19.68 20,22.54 v18.1,24.45
D2  (via drill 0.8 pad 2.3)
  Top 0.61: X2.D2 21.59,45.4 17.78,36.2 17.78,29.53 v20.95,24.45
  Bottom 0.406: 1D1.42 38.56,24.91 34.13,20.95 29.21,20.95 v20.95,24.45
D3  (via drill 0.8 pad 2.3)
  Top 0.61: X2.D3 24.45,45.72 22.07,42.7 22.07,38.1 22.54,34.45 v25.72,25.72
  Bottom 0.406: 1D1.43 37.78,27.83 37.78,26.04 33.66,22.23 29.21,22.23 v25.72,25.72
D4  (via drill 0.8 pad 2.3)
  Top 0.61: X2.D4 26.99,45.72 23.34,42.23 23.34,39.05 24.29,33.66 v28.57,25.72
  Bottom 0.406: v28.57,25.72 30.8,23.5 33.18,23.5 36.88,26.67 36.96,26.74 1D1.44
GND  (via drill 0.8 pad 2.3)  (1 unrouted)
  Top 0.406: 4VT1.2 4R3.1 47.3,35.88 50.64,35.88 4C1.1 51.88,34.29 | 67.31,42.86 63.18,42.86 | X2.GND2 69.53,48.26 70.17,48.9 | 10,19.05 10.48,19.05 | v57.47,37.47 59.37,40.64
  Top 0.61: X2.GND 63.18,44.13 63.18,42.86 60.8,42.07 59.37,40.64 | 1VT3.2 66.36,39.69 67.31,40.49 67.31,42.86 67.31,43.81 v69.53,45.09
  Top 0.813: 23.34,23.34 22.38,26.35
  Top 1.016: 51.88,34.29 v54.61,34.61 56.52,35.88 v57.47,37.47 | 22.38,26.35 v19.68,30.8
  Top 1.27: USB.S1 10.48,19.05 | 10.48,19.05 USB.S2 | 3C4.2 27.62,17.3 3C1.2 23.34,20 | 23.34,23.34 23.34,20 | v69.53,45.09 69.53,48.26 | 10.48,19.05 11.11,18.41 17.14,18.41 20.95,20 23.34,20
  Bottom 0.305: 12.77,37.78 2D1.26 12.77,40.96 | 12.77,40.96 12.12,40.96 2D1.25 | 10.16,34.92 2D1.7 10.17,30.79 10.16,28.89 2C5.1 | 12.77,40.96 12.7,41.02 12.7,42.65 2R1.1 12.7,43.08 12.7,43.81 11.75,44.13 9.53,44.45 7.94,44.45 7.94,42.55 8.57,41.91 9.53,41.59 2D1.21 | 2D1.18 7.57,40.59 6.25,41.91 | 9.21,48.26 2C2.1 | 1R6.1 U$2.P$1
  Bottom 0.406: 1D1.18 41.76,36.98 45.09,33.66 1D1.28 48.73,33.66 1R5.1 50.97,33.34 51.91,33.5 v54.61,34.61 | 12.77,37.78 10.16,34.92 | 1D2.10 63.82,37.15 62.23,38.42 1D2.8 | 1D1.6 29.84,33.66 | 2C2.1 9.11,48.26 9.11,48.9 6.35,48.9 2C3.2 | 70.17,37.15 1R8.1 | 3D1.4 33.34,5.08 31.75,5.4 31.75,7.3 33.34,7.62 3D1.2 34.92,7.62 3C4.2 | 68.15,18.41 S2.1 RJ9.1 | v34.77,27.15 35.56,28.26 37.78,30.48 39.69,30.48 40.96,29.21 1D1.39 40.96,23.18 1C1.1 39.05,20.64 37.47,18.41 | 6.25,41.91 2.22,41.91 1.91,42.23 1.91,45.56 2C4.1 7.94,44.45 | 69.53,49.53 X2.P$1 19.9,49.53 2R11.2 | 2C5.1 11.74,21.26 USB.S1
  Bottom 0.61: 29.84,33.66 27.78,31.27 24.13,31.27 1C5.1 1C4.1 | 71.6,37.15 71.6,31.43 71.6,28.1 S2.2 | 3R3.1 3D1.4 | 1D2.10 1R8.1 | 1D2.15 1C9.2 | 1D2.8 59.05,38.42 v57.47,37.47
  Bottom 0.813: 1C9.2 71.6,31.43 | RJ6.1 64.92,15.07 | 2C2.1 2C1.1 | 27.78,16.83 35.24,16.83 37.47,18.41 | 2C3.2 2C4.1 | 3C3.- 41.59,9.21 37.47,9.21 3C4.2
  Bottom 1.016: v19.68,30.8 1C5.1 | ISP6.6 71.6,37.15 70.17,37.15 | 64.92,15.07 66.99,17.46 68.15,18.41 | 27.78,16.83 3C1.2 | 3C3.- 45.85,11.94 3C5.1
  Bottom 1.27: S2.1 U$2.P$1 S2.2 | 69.53,49.53 v69.53,45.09 | 3C2.- 3C1.2
  Bottom 1.676: USB.S2 USB.4
MISO8535  (via drill 0.8 pad 2.3)
  Top 0.406: 32.07,48.26 X2.D6 | 29.53,31.59 30.16,32.7
  Top 0.61: 32.07,48.26 32.07,45.72 30.16,41.75 30.16,32.7 | 29.53,31.59 29.53,30 v31.43,28.26 33.18,29.69 35.56,29.69 36.99,28.25 RJ2.2
  Bottom 0.406: 35.13,30.48 1D1.2 33.95,30.45 v31.43,28.26 29.84,27.62 23.81,27.62 22.54,26.35 16.64,26.35 JI.2
MOSI8535  (via drill 0.8 pad 2.3)
  Top 0.406: ISP6.4 71.44,37.47 71.44,38.73 72.39,40.01 77.47,40.01 79.22,38.26 79.22,32.38 78.74,31.27 78.74,13.34 78.26,12.86 78.26,3.17 75.72,0.64 66.67,0.64 62.87,4.45 62.87,6.99 59.37,10.48 52.07,10.48 45.09,15.24 41.91,15.24 v31.75,25.4 | 28.42,31.75 29.05,32.86
  Top 0.61: v31.75,25.4 28.42,28.42 28.42,31.75 | X2.D5 29.84,45.72 v26.51,42.07 29.05,39.85 29.05,32.86
  Bottom 0.406: v26.51,42.07 24.57,40.48 JO.2 | v31.75,25.4 33.73,28.81 1D1.1
N4
  Bottom 0.406: 46.76,27.3 53.82,27.3 55.56,28.57 59.05,28.57 60.01,29.53 1D2.1 | 1HL1.K 45.4,25.4 46.76,26.75 46.76,27.3 | 46.76,27.3 1D1.33
N$1
  Top 0.406: X2.RESET 66.99,46.19
  Top 0.61: 66.99,46.19 RJ7.2
N$2
  Bottom 0.406: 1D1.4 33.35,32.05 32.38,32.89 30.48,32.89 28.57,30.16 21.91,30.16 20.64,28.89 19.21,28.89 RJ1.2
N$3
  Top 0.406: ISP6.1 76.52,30.8 76.52,15.08 75.72,14.29 75.72,4.76 74.14,3.17 67.94,3.17 65.72,5.4 65.72,8.89 61.28,13.34 52.7,13.34 46.35,20.64 42.07,20.64 39.84,22.87 RJ2.1
N$4
  Bottom 0.305: 2D1.4 12.12,33.39
  Bottom 0.406: 12.12,33.39 16.51,37.78 16.51,40.32 RJ5.1
N$5
  Bottom 0.813: 1VT1.2 RJ6.2
N$6
  Top 1.27: 1VD1.C ISP6.2
N$7
  Bottom 0.305: 2D1.9 8.87,27.23 2R7.2
N$9
  Top 0.813: 1VD1.A 62.23,31.27 RJ3.1
N$10
  Top 0.61: RJ4.1 RJ3.2
N$11  (via drill 0.8 pad 5)
  Bottom 1.676: v2.86,7.94 10.64,7.94
N$12
  Bottom 0.406: 1D1.7 35.12,34.42 28.7,34.42 Z1.2 1C5.2
N$13
  Bottom 0.406: 1D1.8 28.88,35.26 Z1.1 1C4.2
N$14
  Bottom 1.27: RJ8.1 USB.1
N$15
  Bottom 0.406: 1C8.1 S1.3 RJ9.2 | 1C2.1 S1.4
  Bottom 1.27: S1.3 U$1.P$1 S1.4
N$16  (via drill 0.8 pad 1.93)
  other vias: 78.9,1.11
N$17  (via drill 0.8 pad 1.93)
  other vias: 1.11,1.11
N$18  (via drill 0.8 pad 1.93)
  other vias: 1.11,51.28
N$19  (via drill 0.8 pad 1.93)
  other vias: 78.9,51.28
N$20
  Bottom 0.61: 1R21.1 1HL3.K
N$21
  Top 0.61: 4VT3.1 4R5.2
N$22
  Bottom 0.406: LED3V3.A 2R11.1
N$45
  Bottom 0.61: 2R5.2 2R4.1
  Bottom 0.813: USB.3 2R5.2
N$46
  Bottom 0.406: USB.2 15.19,16.25 14.29,17.14 12.7,17.22 10.16,15.56 2R3.1
N$47
  Bottom 0.305: 1.91,35.88 2D1.15
  Bottom 0.406: 1.91,35.88 1.91,17.14 5.08,13.97 2R4.2
N$48
  Bottom 0.305: 2D1.16 6.27,38.02 4.34,36.09
  Bottom 0.406: 2R3.2 2.86,18.2 2.86,34.61 4.34,36.09
N$49
  Bottom 0.305: 2D1.23 10.79,39.56 10.79,41.81 2R1.2
N$52
  Bottom 0.305: 2D1.22 10.16,43.18 2R2.2
N$53
  Bottom 0.305: 2D1.28 14.07,40.74 14.92,41.59 14.92,44.01 2Z1.2
  Bottom 0.61: 2Z1.2 2C1.2
N$54
  Bottom 0.305: 2D1.11 7.57,27.89 6.99,27.3 4.13,27.3 3.81,26.99 3.81,20.95
  Bottom 0.406: 3.81,20.95 7.78,16.83 10.37,16.83 13.34,18.99 13.34,20.64 15.24,21.91 15.24,25.08 14.16,26.8 JI.1
N$55
  Top 0.406: 4VT1.1 4R3.2
  Top 0.813: 4R3.2 4R2.2
N$56
  Bottom 0.305: 2D1.27 13.42,41.36 14.16,42.1 14.16,43.62 12.86,44.93 11.21,45.09 2C2.2
  Bottom 1.016: 2Z1.1 2C2.2
N$58
  Bottom 0.305: 2D1.6 10.82,29.19 12.38,26.99 13.97,25.08 13.97,23.27 2R6.1
N$59
  Top 0.406: 4VT2.1 4R4.2 48.26,37.47 46.51,37.78 43.18,37.78 42.72,37.32 4VT1.3
N$60
  Bottom 0.305: 2D1.3 12.77,29.53 JS.1
N$62
  Top 0.406: 4C1.2 4R2.1 41.72,31.46 4R1.2
N$68
  Bottom 0.305: 2D1.13 6.27,30.14 2R9.2
N$69
  Bottom 0.305: 16.19,32.07 16.03,32.07 14.92,31.11 13.65,31.11 13.42,31.35 2D1.2
  Bottom 0.406: 16.19,32.07 18.41,32.07 21.78,34.48 JO.1
N$70
  Bottom 0.305: 2D1.14 5.62,31.23 4.87,30.8 4.87,30.16 2R10.2
N$80
  Bottom 0.305: 2D1.10 8.22,27.43 7.14,26.35 5.18,26.35 2R8.2
N$104
  Bottom 0.61: 3D1.8 3R2.1
N$105
  Bottom 0.61: 3D1.7 26.35,7.62 | 26.35,7.62 26.35,4.56 3R2.2 | 26.35,7.62 3L1.1
  Bottom 0.813: 3R1.2 26.35,4.56
  Bottom 1.422: 3R1A.2 3R1.2
N$106
  Bottom 0.61: 3D1.5 3R3.2 32.07,1.9 33.02,0.95 35.56,0.95 36.51,1.91 3R4.1
N$107
  Bottom 0.61: 3D1.1 3L1.2
  Bottom 0.813: 3L1.2 3VD1.A
N$108
  Bottom 0.406: 3C4.1 3D1.3
N$122
  Bottom 0.813: 1R3.1 1HL2.A
N$123
  Bottom 0.406: 1D1.31 47.62,31.25 | 47.62,31.25 48.12,31.25 49.21,30.16 50.33,30.16 1R5.2 52.55,30.01 1R4.1 | 1D1.30 47.62,32.05 47.62,31.25
N$124
  Bottom 0.406: 1D1.32 47.65,30.45 49.21,28.26 53.34,28.26 55.24,29.84 58.42,29.84 59.37,30.8 1D2.2 62.23,30.8 62.87,30.16 62.87,28.89 61.28,27.3 55.88,27.3 53.34,25.4 1HL2.K
N$125  (via drill 0.8 pad 2.3)
  Top 0.61: S2.4 71.36,26.56 69.25,27.94 65.72,29.05 60.01,29.05 v57.15,31.59
  Bottom 0.406: 1D2.6 59.69,35.88 58.1,34.29 v57.15,31.59
  Bottom 1.016: S2.4 1R10.2
  Bottom 1.27: S2.4 U$2.P$2 S2.3
N$131  (via drill 0.8 pad 2.3)
  Top 0.61: v33.34,39.53 41.27,28.42 56.99,28.42 HW.1
  Bottom 0.406: 1D1.12 v33.34,39.53
N$132
  Bottom 0.406: 62.23,18.41 61.91,16.51 1R20.2
  Bottom 0.61: 62.23,18.41 1R6.2 HW.2
N$133  (via drill 0.8 pad 2.3)
  Top 0.406: 1R19.2 64.77,32.86 65.25,33.18 68.42,33.18 68.74,32.86 68.74,29.84 71.12,28.26 74.3,28.26 75.25,27.3 75.25,16.19 74.61,15.56 65.09,15.56 63.82,16.19 1VD2.C v59.37,19.68
  Bottom 0.61: 1HL3.A 1VT2.C v59.37,19.68
N$134
  Bottom 0.813: 1VT1.1 1R20.1
N$135
  Bottom 0.813: 1VT1.3 1R17.1
N$136
  Bottom 0.406: 1R18.1
  Bottom 0.813: 1R17.2 1R18.1 | 1R18.1 1VT2.B
N$137  (via drill 0.8 pad 2.3)
  Top 0.406: v36.83,44.13 39.37,40.64 39.37,37.94 42.39,32.86 53.02,32.86 53.98,32.7 55.56,32.7 56.36,33.5 59.21,33.5 62.23,36.35 v62.55,40.64
  Bottom 0.406: v62.55,40.64 64.45,38.42 1D2.9 | 1D1.15 39.36,40.75 38.83,41.44 v36.83,44.13
N$138
  Bottom 0.813: 1HL1.A 1R2.1
N$139
  Bottom 0.406: 1D2.14 1D2.13 68.9,33.34 69.53,33.82 69.53,35.25 1R8.2 68.58,35.88 1D2.11
N$140
  Bottom 0.406: 1D2.12 1D2.5 1D2.4 1D2.3 62.55,32.07 64.45,31.59 64.45,30.48 64.45,29.53 64.45,28.57 64.45,27.78 1R9.2
N$141
  Top 0.406: 1VT3.1 1R16.2
PD2  (via drill 0.8 pad 2.3)
  Top 0.61: v69.22,41.91 1R16.1
  Bottom 0.305: 31.88,37.66 1D1.11
  Bottom 0.406: 31.88,37.66 30.8,40.01 30.8,41.27 34.29,46.04 66.04,46.04 v69.22,41.91
PD5  (via drill 0.8 pad 2.3)
  Top 0.813: 4R1.1 v34.92,41.91
  Bottom 0.406: 1D1.14 38.56,40.5 37.15,41.91 v34.92,41.91
PD7  (via drill 0.8 pad 2.3)
  Top 0.406: 4VT3.3 45.1,39.22 JX.1 42.01,39.88 v40.64,41.72
  Bottom 0.406: 1D1.16 40.16,40.49 v40.64,41.72
PPC0(BS2)  (via drill 0.8 pad 2.3)
  Top 0.406: 37.78,46.04 X2.BS2
  Top 0.61: v39.69,44.13 37.78,46.04
  Bottom 0.406: 1D1.19 42.56,41.9 41.59,43.5 v39.69,44.13
PPC1(RB)  (via drill 0.8 pad 2.3)
  Top 0.813: v43.5,43.81 X2.RB
  Bottom 0.406: 1D1.20 43.36,42.05 v43.5,43.81
PPC2(OE)  (via drill 0.8 pad 2.3)
  Top 0.813: v46.04,43.81 X2.OE
  Bottom 0.406: 1D1.21 44.16,41.3 v46.04,43.81
PPC3(WR)  (via drill 0.8 pad 2.3)
  Top 0.813: v48.58,43.81 X2.WR
  Bottom 0.406: 1D1.22 44.96,40.2 v48.58,43.81
PPC4(BS1)  (via drill 0.8 pad 2.3)
  Top 0.813: v51.12,43.81 X2.BS1
  Bottom 0.406: v51.12,43.81 50.48,42.55 48.77,39.24 47.18,37.66 1D1.23
PPC5(XA0)  (via drill 0.8 pad 2.3)
  Top 0.813: v53.66,43.81 X2.XA0
  Bottom 0.406: 1D1.24 47.97,36.85 53.02,41.91 v53.66,43.81
PPC6(XA1)  (via drill 0.8 pad 2.3)
  Top 0.813: v56.2,43.97 X2.XA1
  Bottom 0.406: 1D1.25 48.76,36.05 55.56,42.55 v56.2,43.97
PPC7(PAGEL)  (via drill 0.8 pad 2.3)
  Top 0.813: v58.9,44.29 X2.PAGEL
  Bottom 0.406: 1D1.26 49.86,35.26 57.78,42.86 v58.9,44.29
RESET8535  (via drill 0.8 pad 2.3)
  Top 0.406: 23.65,26.67 24.13,24.45 26.04,22.54
  Top 0.61: 23.65,26.67 20.95,33.66 v20,35.56 | v39.69,14.61 26.04,22.54
  Bottom 0.406: JR.2 19.68,37.3 v20,35.56 17.93,33.49 RJ1.1 | 1C8.2 S1.1 78.1,15.28 1R1.1 78.11,29.84 78.74,30.8 78.74,38.73 JP2.1 | S1.2 70.6,3.49 57.15,3.49 54.93,5.71 53.34,10.48 46.83,14.61 43.34,14.61
  Bottom 0.61: RES.3 JP2.1 | v39.69,14.61 43.34,14.61
  Bottom 1.27: S1.2 U$1.P$2 S1.1
RESET(P)
  Bottom 0.61: RES.2 JP2.2
  Bottom 0.813: ISP6.5 JP2.2
RX_AVR
  Bottom 0.406: 1D1.10 31.09,36.85 29.37,40.32 29.37,44.26 28.26,45.4 24.77,45.4 23.5,44.13 J1.2
RX_USB
  Bottom 0.305: 2D1.5 11.47,34.25 11.43,34.61
  Bottom 0.406: J1.1 18.41,44.13 15.88,42.23 15.88,41.27 15.24,40.32 15.24,38.42 11.43,34.61
SCK8535  (via drill 0.8 pad 2.3)
  Top 0.406: X2.D7 35.03,48.14 | 35.03,48.14 34.61,46.67 | 35.03,46.46 35.03,48.14 | ISP6.3 78.11,34.92 78.11,32.38 77.63,31.59 77.63,14.29 76.99,13.65 76.99,3.97 74.93,1.91 67.31,1.91 64.45,4.76 64.45,7.78 60.33,11.91 52.39,11.91 46.35,16.67 43.18,16.67 38.42,21.43 38.42,29.21
  Top 0.61: 35.03,46.46 31.43,41.27 v31.43,31.11 36.51,31.11 38.42,29.21
  Bottom 0.406: 1D1.3 34.11,31.25 v31.43,31.11 28.89,28.89 22.86,28.89 21.59,27.62 19.37,27.62 JS.2
SWCLK(XTAL1)
  Top 0.406: X2.XTAL1 40.77,48.45 40.64,48.32 41.59,43.65 42.86,41.42 | 4VT3.2 42.86,41.42 | 42.86,41.42 JX.2
TRST(RESET)
  Top 0.406: JP2.3 70.01,39.21 70.01,35.4 69.37,34.77 65.09,34.77 64.93,34.76 1R19.1 1VT3.3
  Top 0.61: RJ7.1 63.99,38.59 1VT3.3
  Bottom 0.61: RES.1 JP2.3
TX_AVR
  Bottom 0.406: 1D1.9 30.3,36.05 28.42,39.85 28.42,43.02 27.62,43.97 25.56,43.97 23.5,41.91 J2.2
TX_USB
  Bottom 0.305: 14.07,33.12 2D1.1
  Bottom 0.406: JR.1 18.38,39.81 17.78,39.21 17.78,37.15 14.07,33.12
  Bottom 0.61: JR.1 J2.1
VTG
  Top 0.406: 4VT2.3 54.27,41.42 JV.2 | 58.9,42.07 60.8,43.34
  Top 0.61: 60.8,43.34 X2.VCC | JV.2 RJ4.2 58.9,42.07 | 4R5.1 4VT2.3

### Text on the board
Top: STK500 | HWPROG | USB-SP | HV | 1173-15
Bottom: 1173-15
bJumper: 1 | 1
tJumper: T | P